# EAGLE design openSX70-bench-new-v2-1 (EAGLE 9.2.0)
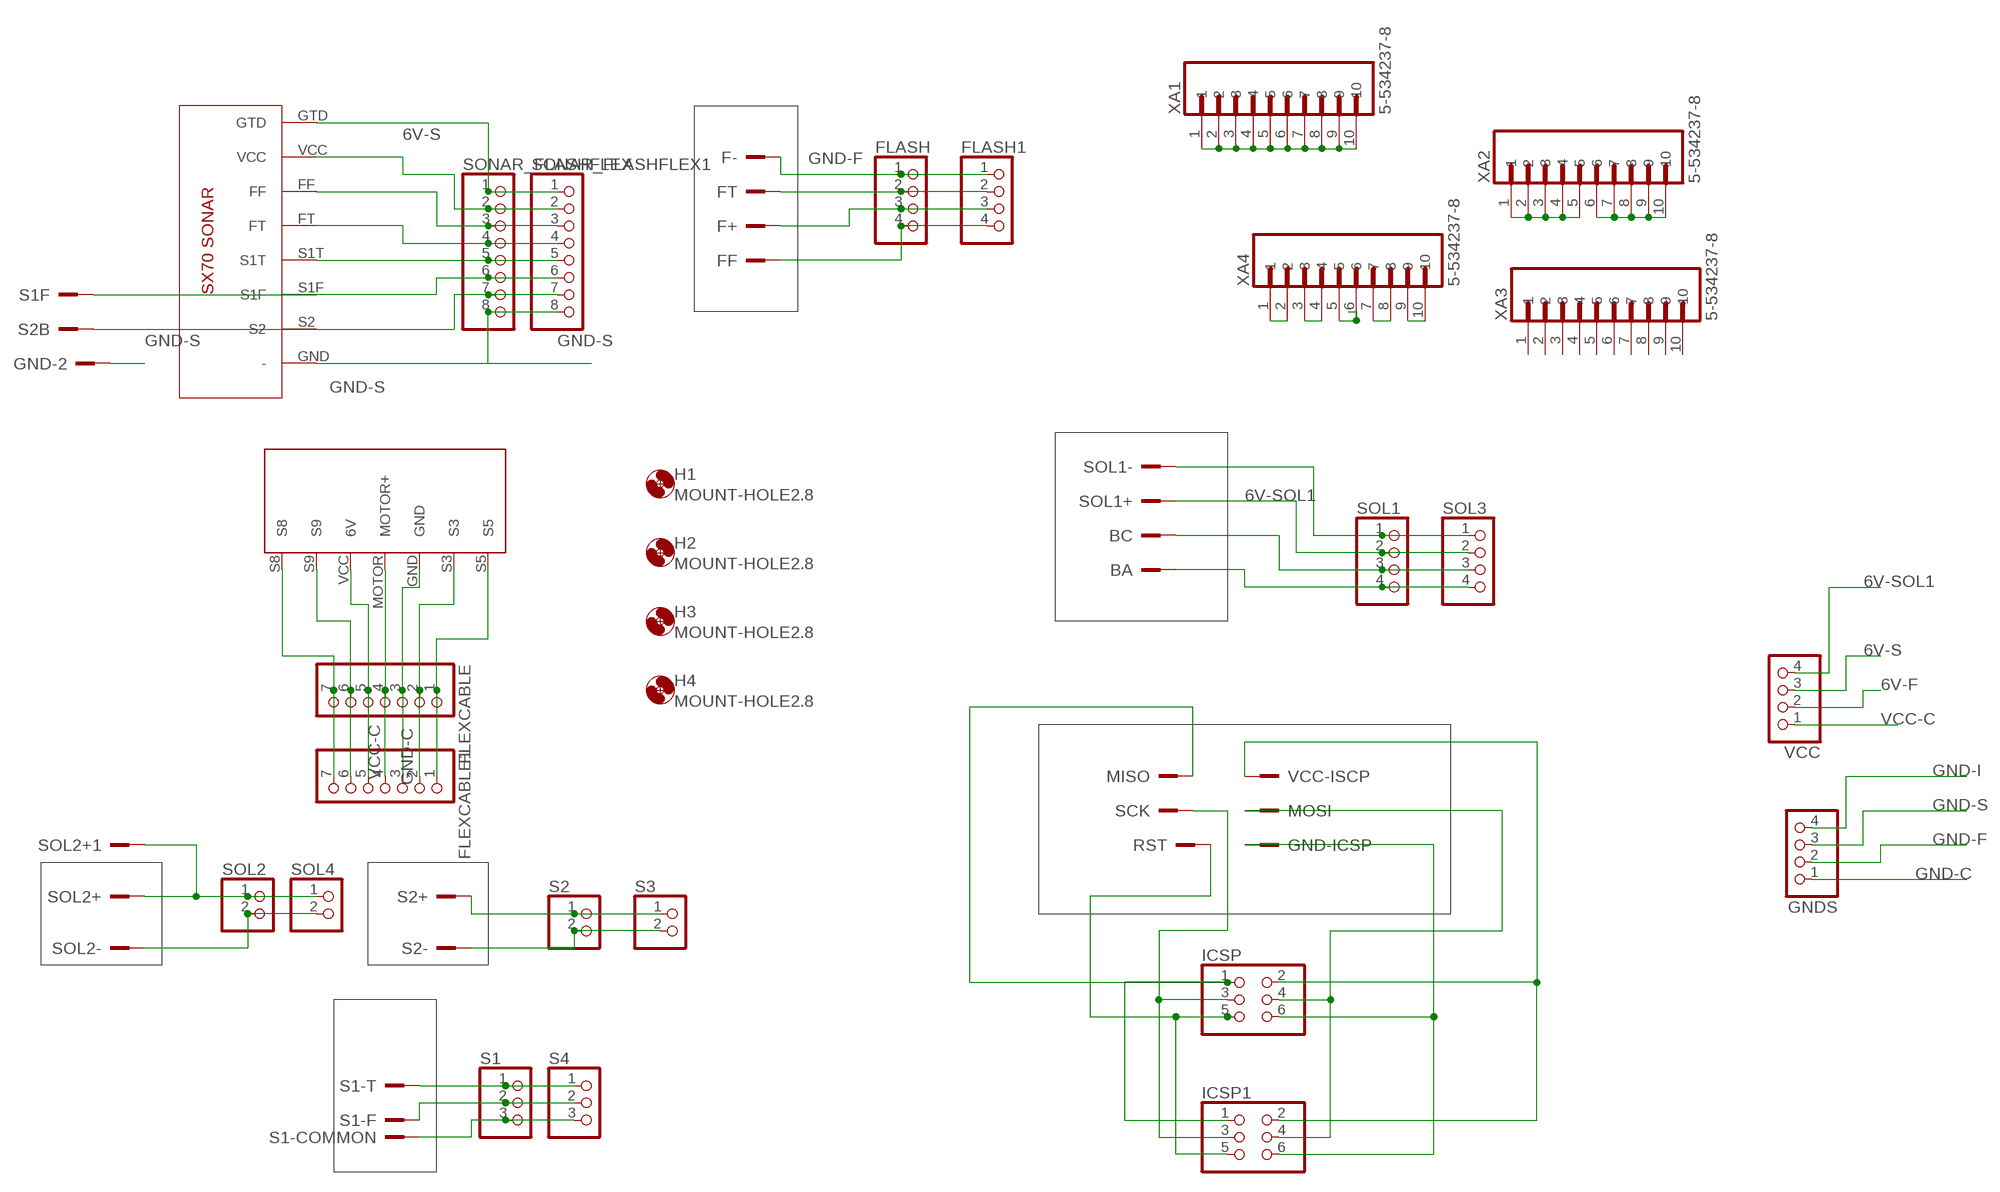
[diagram p0: schematic, sheet 1]

## Parts
BA  PINHEAD  [1X01]
BC  PINHEAD  [1X01]
F+  PINHEAD  [1X01]
F-  PINHEAD  [1X01]
FF  PINHEAD  [1X01]
FLASH  PINHD-1X4  [1X04]
FLASH1  PINHD-1X4  [1X04]
FLEXCABLE  PINHD-1X7  [1X07]
FLEXCABLE1  PINHD-1X7  [1X07]
FT  PINHEAD  [1X01]
GND-2  PINHEAD  [1X01]
GND-ICSP  PINHEAD  [1X01]
GNDS  PINHD-1X4  [1X04]
H1  MOUNT-HOLE2.8  [2,8]
H2  MOUNT-HOLE2.8  [2,8]
H3  MOUNT-HOLE2.8  [2,8]
H4  MOUNT-HOLE2.8  [2,8]
ICSP  PINHD-2X3  [2X03]
ICSP1  PINHD-2X3  [2X03]
MISO  PINHEAD  [1X01]
MOSI  PINHEAD  [1X01]
RST  PINHEAD  [1X01]
S1  PINHD-1X3  [1X03]
S1-COMMON  PINHEAD  [1X01]
S1-F  PINHEAD  [1X01]
S1-T  PINHEAD  [1X01]
S1F  PINHEAD  [1X01]
S2  PINHD-1X2  [1X02]
S2+  PINHEAD  [1X01]
S2-  PINHEAD  [1X01]
S2B  PINHEAD  [1X01]
S3  PINHD-1X2  [1X02]
S4  PINHD-1X3  [1X03]
SCK  PINHEAD  [1X01]
SOL1  PINHD-1X4  [1X04]
SOL1+  PINHEAD  [1X01]
SOL1-  PINHEAD  [1X01]
SOL2  PINHD-1X2  [1X02]
SOL2+  PINHEAD  [1X01]
SOL2+1  PINHEAD  [1X01]
SOL2-  PINHEAD  [1X01]
SOL3  PINHD-1X4  [1X04]
SOL4  PINHD-1X2  [1X02]
SONAR_FLASHFLEX  PINHD-1X8  [1X08]
SONAR_FLASHFLEX1  PINHD-1X8  [1X08]
U$1  SX70-7-PAD-HOLES-PROPER  [SX70-7-PAD-PROPER-HOLES2]
U$2  SX70-SONAR-FLASHFLEX-HOLES  [SONAR-FLASHFLEX-HOLES]
VCC  PINHD-1X4  [1X04]
VCC-ISCP  PINHEAD  [1X01]
XA1  5-534237-8  [TE_5-534237-8]
XA2  5-534237-8  [TE_5-534237-8]
XA3  5-534237-8  [TE_5-534237-8]
XA4  5-534237-8  [TE_5-534237-8]

## Nets
6V-F: F+.1(KL) FLASH1.3 FLASH.3 VCC.2
6V-I: ICSP1.2 ICSP.2 VCC-ISCP.1(KL)
6V-S: SONAR_FLASHFLEX1.2 SONAR_FLASHFLEX.2 U$2.VCC VCC.3
6V-SOL1: SOL1+.1(KL) SOL1.2 SOL3.2 VCC.4
GND-C: FLEXCABLE1.3 FLEXCABLE.3 GNDS.1 U$1.GND
GND-F: F-.1(KL) FLASH1.1 FLASH.1 GNDS.2
GND-I: GND-ICSP.1(KL) GNDS.4 ICSP1.6 ICSP.6
GND-S: GND-2.1(KL) GNDS.3 SONAR_FLASHFLEX1.8 SONAR_FLASHFLEX.8 U$2.GND(-)
N$1: FLEXCABLE1.7 FLEXCABLE.7 U$1.S8
N$2: FLEXCABLE1.6 FLEXCABLE.6 U$1.S9
N$3: XA1.1 XA1.2 XA1.3 XA1.4 XA1.5 XA1.6 XA1.7 XA1.8 XA1.9 XA1.10
N$4: FLEXCABLE1.4 FLEXCABLE.4 U$1.MOTOR(MOTOR+)
N$5: XA4.1 XA4.2
N$6: FLEXCABLE1.2 FLEXCABLE.2 U$1.S3
N$7: FLEXCABLE1.1 FLEXCABLE.1 U$1.S5
N$8: ICSP1.1 ICSP.1 MISO.1(KL)
N$9: ICSP1.3 ICSP.3 SCK.1(KL)
N$10: ICSP1.5 ICSP.5 RST.1(KL)
N$11: XA4.3 XA4.4
N$12: ICSP1.4 ICSP.4 MOSI.1(KL)
N$13: S2B.1(KL) SONAR_FLASHFLEX1.7 SONAR_FLASHFLEX.7 U$2.S2
N$14: S1F.1(KL) SONAR_FLASHFLEX1.6 SONAR_FLASHFLEX.6 U$2.S1F
N$15: SONAR_FLASHFLEX1.5 SONAR_FLASHFLEX.5 U$2.S1T
N$16: SONAR_FLASHFLEX1.1 SONAR_FLASHFLEX.1 U$2.GTD
N$17: SONAR_FLASHFLEX1.3 SONAR_FLASHFLEX.3 U$2.FF
N$18: SONAR_FLASHFLEX1.4 SONAR_FLASHFLEX.4 U$2.FT
N$19: XA4.5 XA4.6
N$20: XA4.7 XA4.8
N$21: S1-COMMON.1(KL) S1.3 S4.3
N$22: S1-F.1(KL) S1.2 S4.2
N$23: FLASH1.2 FLASH.2 FT.1(KL)
N$24: S1-T.1(KL) S1.1 S4.1
N$25: FF.1(KL) FLASH1.4 FLASH.4
N$26: SOL1-.1(KL) SOL1.1 SOL3.1
N$27: XA4.9 XA4.10
N$28: BC.1(KL) SOL1.3 SOL3.3
N$29: BA.1(KL) SOL1.4 SOL3.4
N$30: XA2.1 XA2.2 XA2.3 XA2.4 XA2.5
N$31: XA2.6 XA2.7 XA2.8 XA2.9 XA2.10
N$34: SOL2+1.1(KL) SOL2+.1(KL) SOL2.1 SOL4.1
N$35: SOL2-.1(KL) SOL2.2 SOL4.2
N$38: S2+.1(KL) S2.1 S3.1
N$39: S2-.1(KL) S2.2 S3.2
VCC-C: FLEXCABLE1.5 FLEXCABLE.5 U$1.VCC(6V) VCC.1
Unconnected: XA3.1 XA3.2 XA3.3 XA3.4 XA3.5 XA3.6 XA3.7 XA3.8 XA3.9 XA3.10

## Library data of the parts
BA BC F+ F- FF FT GND-2 GND-ICSP MISO MOSI RST S1-COMMON S1-F S1-T S1F S2+ S2- S2B SCK SOL1+ SOL1- SOL2+ SOL2+1 SOL2- VCC-ISCP = openSX70:PINHEAD
FLASH FLASH1 GNDS SOL1 SOL3 VCC = pinhead:PINHD-1X4: PIN HEADER
FLEXCABLE FLEXCABLE1 = pinhead:PINHD-1X7: PIN HEADER
H1-H4 = holes:MOUNT-HOLE: MOUNTING HOLE with drill center marker
ICSP ICSP1 = pinhead:PINHD-2X3: PIN HEADER
S1 S4 = pinhead:PINHD-1X3: PIN HEADER
S2 S3 SOL2 SOL4 = pinhead:PINHD-1X2: PIN HEADER
SONAR_FLASHFLEX SONAR_FLASHFLEX1 = pinhead:PINHD-1X8: PIN HEADER
U$1 = openSX70:SX70-7-PAD-HOLES-PROPER
U$2 = _openSX70:SX70-SONAR-FLASHFLEX-HOLES
XA1-XA4 = Common-Parts-Library-Eagle:5-534237-8: Conn Socket Strip SKT 10 POS 2.54mm Solder ST Thru-Hole Tube; MANUFACTURER: TE Connectivity

## Net classes
0 default: width 0.305 mm
1 GND: width 0.508 mm
2 VCC: width 0.508 mm

## Board
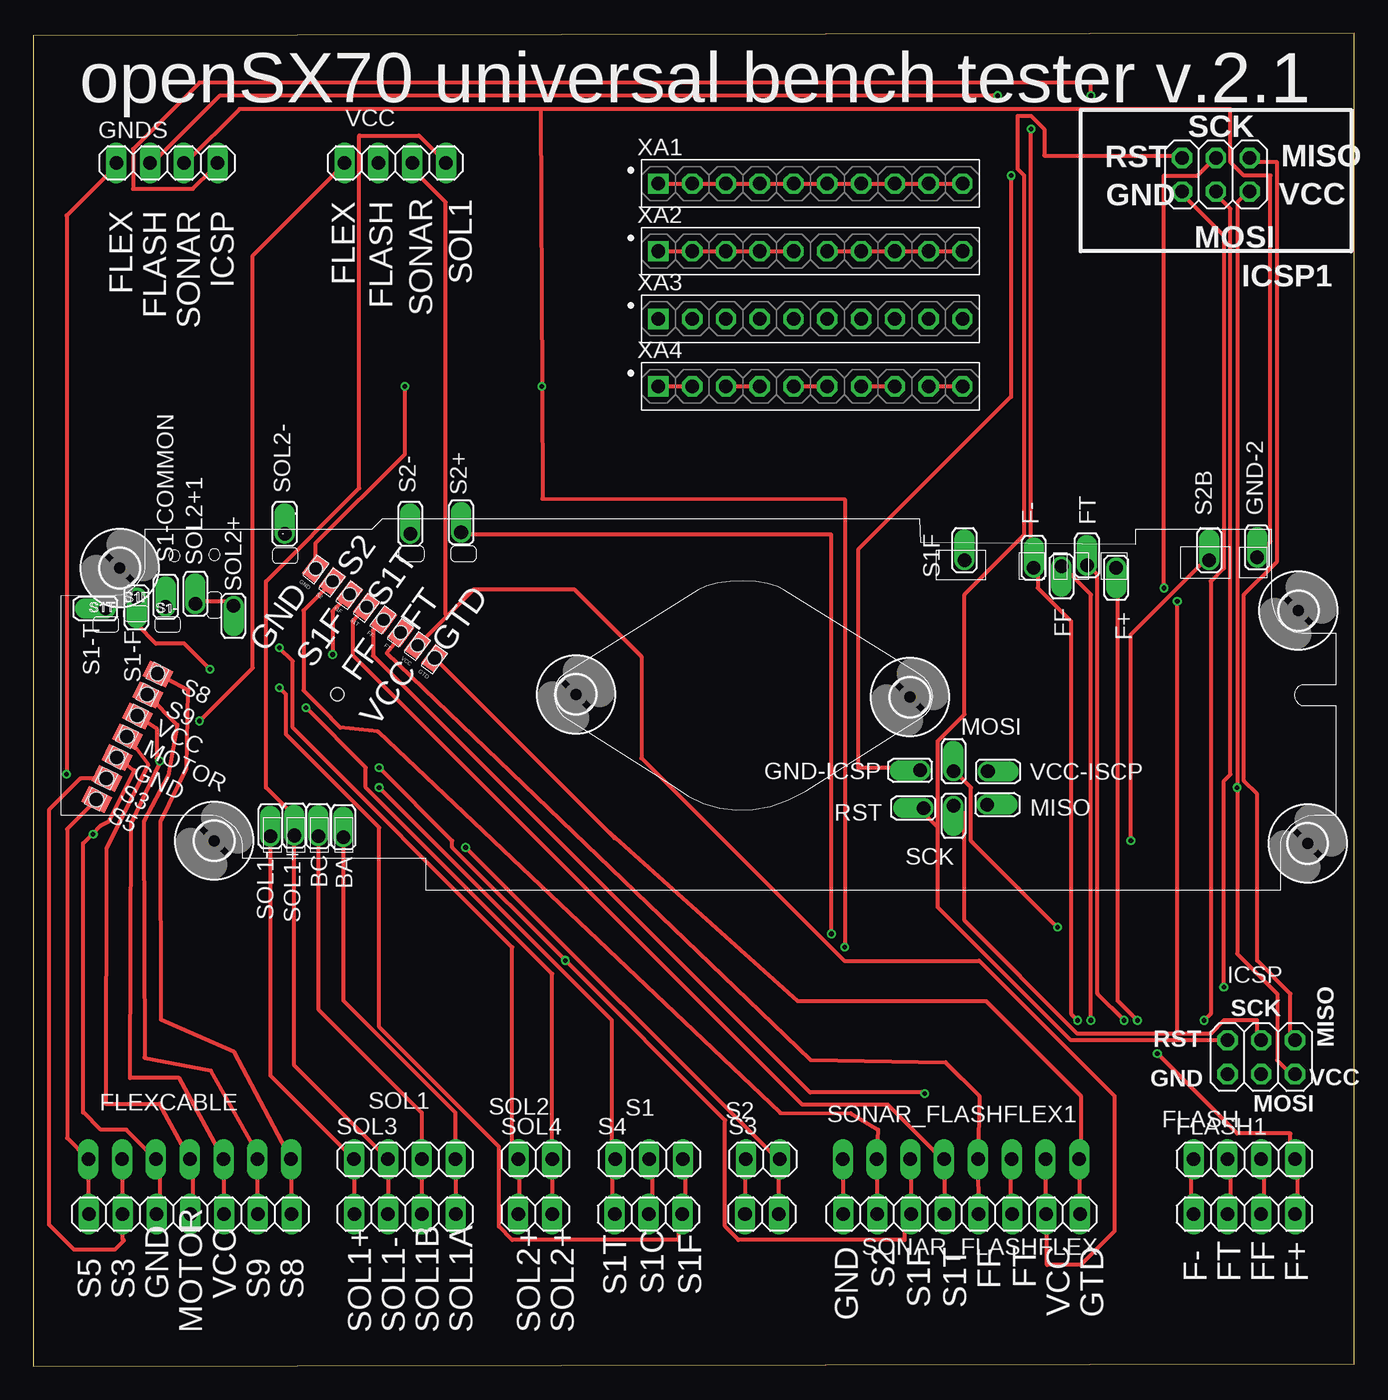
[diagram p1: board, top side]
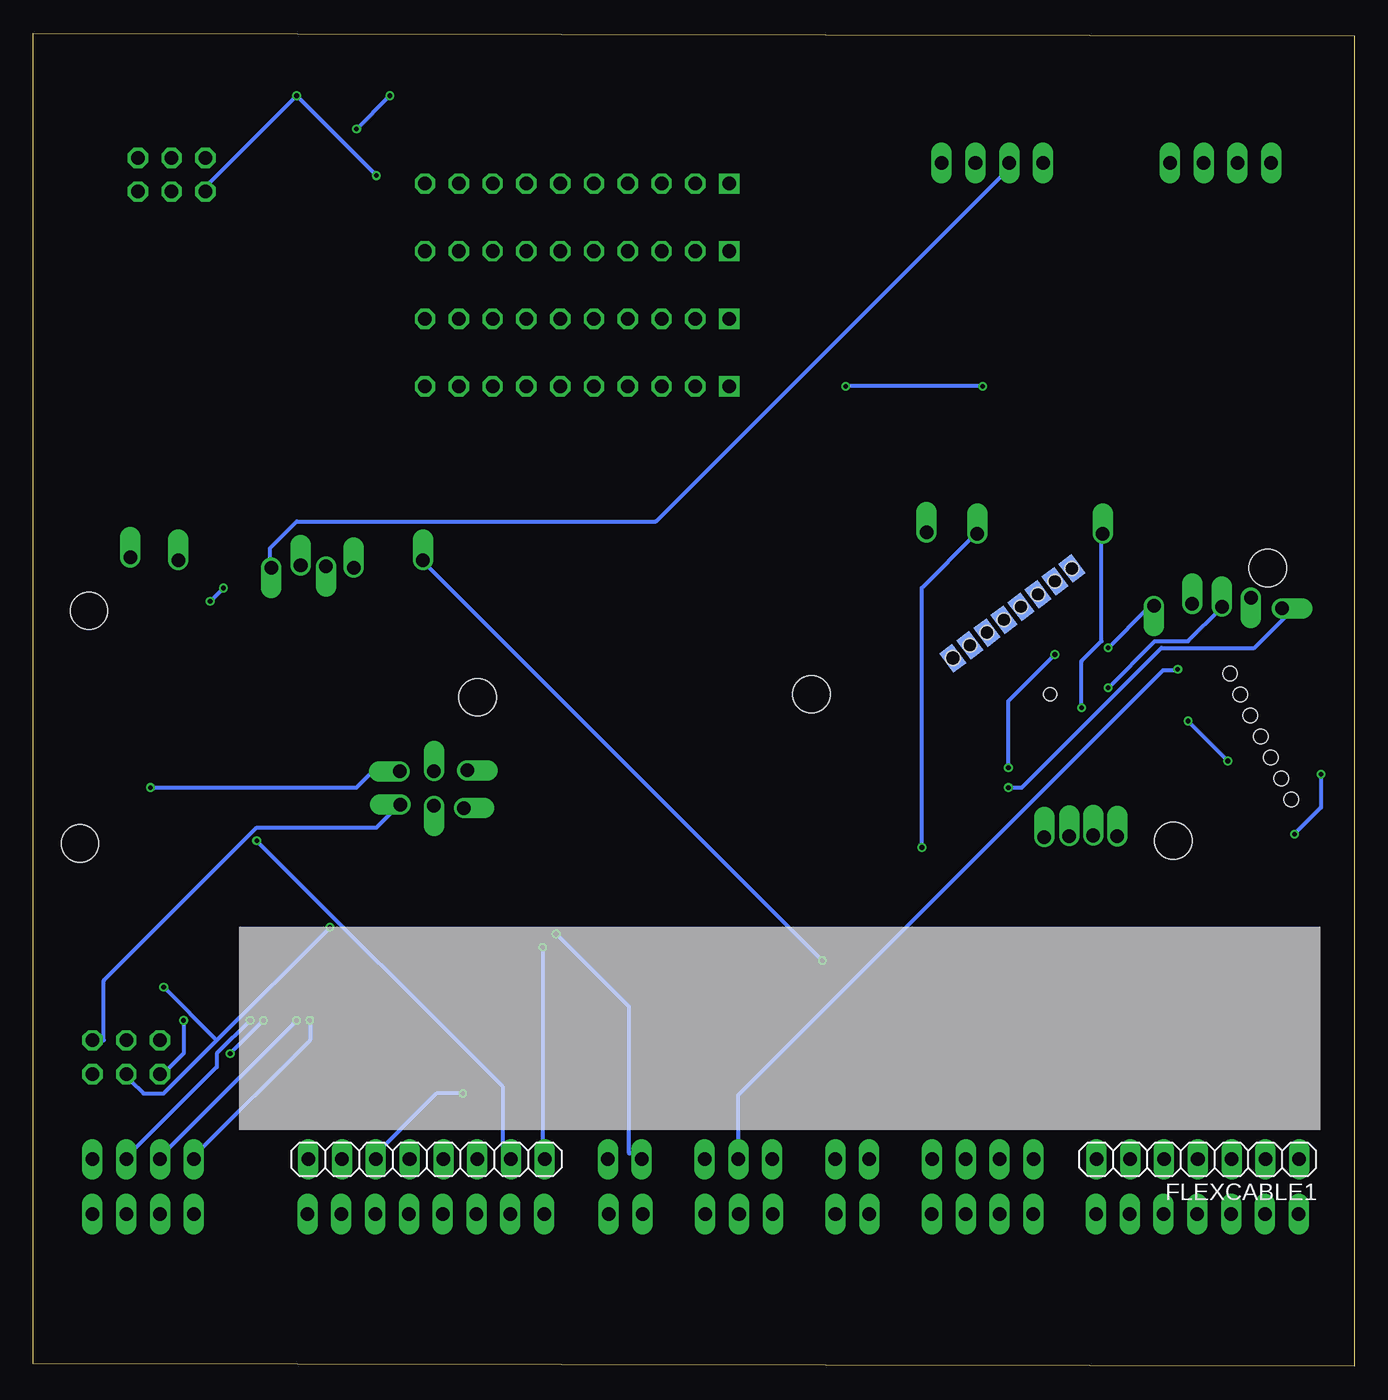
[diagram p2: board, bottom side, seen from below]

Size 99.3 x 100.2 mm. Coordinates in mm from the lower left corner, seen from the top.
Outline: 0,0 99.3,0.2 99.3,100.2 0,100 0,0
Copper layers (1*16): Top 0.035mm / dielectric 1.5mm / Bottom 0.035mm
Design rules "SeeedStudio_2layer_DRU_no_angle_20140221": minimum track width 6mil, minimum drill 12mil, track to track 6mil, track to pad 6mil, pad to pad 6mil, via to via 6mil, smd to smd 0mil, copper to edge 10mil, drill to drill 10mil, minimum pad ring 10mil, minimum via ring 6mil, stop-mask expansion 2mil, vias tented up to drill 100mil, thermal gap 10mil
Holes 1 mm at 22.87,50.52

### Footprints (pad centres in the part's own frame; a part is rotated, then mirrored left to right if it is on the bottom)
1X01 = drill 1.016 offset: 1 0,0
1X04 = drill 1.016 long: 1 -3.81,0; 2 -1.27,0; 3 1.27,0; 4 3.81,0
1X07 = drill 1.016 long: 1 -7.62,0; 2 -5.08,0; 3 -2.54,0; 4 0,0; 5 2.54,0; 6 5.08,0; 7 7.62,0
2,8 = hole 2.8: 0,0
2X03 = drill 1.016 octagon: 1 -2.54,-1.27; 2 -2.54,1.27; 3 0,-1.27; 4 0,1.27; 5 2.54,-1.27; 6 2.54,1.27
1X03 = drill 1.016 long: 1 -2.54,0; 2 0,0; 3 2.54,0
1X02 = drill 1.016 long: 1 -1.27,0; 2 1.27,0
1X08 = drill 1.016 long: 1 -8.89,0; 2 -6.35,0; 3 -3.81,0; 4 -1.27,0; 5 1.27,0; 6 3.81,0; 7 6.35,0; 8 8.89,0
SX70-7-PAD-PROPER-HOLES2 = smd 1.31 x 1.93: GND 7.875,1.355; MOTOR 6.125,1.355; S3 9.625,1.355; S5 11.375,1.355; S8 0.875,1.355; S9 2.625,1.355; VCC 4.375,1.355 | hole 1.1: 0.875,1.312; 2.625,1.312; 4.375,1.312; 6.125,1.312; 7.875,1.312; 9.625,1.312; 11.375,1.312
SONAR-FLASHFLEX-HOLES = smd 1.2 x 1.78: FF -3.2,-0.8; FT -4.8,-0.8; GND 3.2,-0.8; GTD -8,-0.8; S1 1.6,-0.8; S1F 0,-0.8; S1T -1.6,-0.8; S2 1.6,-0.8; VCC -6.4,-0.8 | smd 1.2 x 1.78 bottom: FFB -3.2,-0.8; FTB -4.8,-0.8; GNDB 3.2,-0.8; GTDB -8,-0.8; S1FB 0,-0.8; S1TB -1.6,-0.8; S2B 1.6,-0.8; VCCB -6.4,-0.8 | hole 1.1: -8,-0.8 | hole 1: -6.4,-0.8; -4.8,-0.8; -3.2,-0.8; 3.2,-0.8; -1.6,-0.8; 0,-0.8; 1.6,-0.8
TE_5-534237-8 = drill 1.016 square: 1 -11.43,0 | drill 1.016 octagon: 2 -8.89,0; 3 -6.35,0; 4 -3.81,0; 5 -1.27,0; 6 1.27,0; 7 3.81,0; 8 6.35,0; 9 8.89,0; 10 11.43,0

### Placement (x,y rotation side)
BA  23.3,39.78 90 top
BC  21.42,39.86 90 top
F+  81.4,60.02 270 top
F-  75.2,60.02 90 top
FF  79.2,60.2 90 top
FLASH  91.04,11.44 0 top
FLASH1  91.04,15.56 0 top
FLEXCABLE  11.8,11.44 0 top
FLEXCABLE1  11.76,15.56 180 bottom
FT  77.3,60.12 270 top
GND-2  92,60.8 90 top
GND-ICSP  66.68,44.79 180 top
GNDS  10.05,90.45 0 top
H1  6.5,60 180 top
H2  13.6,39.5 0 top
H3  95.8,39.3 0 top
H4  95.1,56.8 0 top
H5  MOUNT-HOLE2.8  [2,8]  40.8,50.5 0 top
H6  MOUNT-HOLE2.8  [2,8]  65.9,50.3 0 top
ICSP  92.31,23.23 180 top
ICSP1  88.9,89.57 180 top
MISO  71.7,42.22 0 top
MOSI  69.18,44.74 90 top
RST  66.92,41.96 180 top
S1  46.25,11.44 0 top
S1-COMMON  9.95,57.09 90 top
S1-F  7.76,57.78 270 top
S1-T  5.44,56.96 180 top
S1F  70,60.6 90 top
S2  54.77,11.44 0 top
S2+  32.16,62.68 90 top
S2-  28.34,62.58 90 top
S2B  88.4,60.6 90 top
S3  54.84,15.56 0 top
S4  46.29,15.56 0 top
SCK  69.18,42.12 270 top
SOL1  27.94,11.44 0 top
SOL1+  19.62,39.9 90 top
SOL1-  17.82,39.84 90 top
SOL2  37.73,11.44 0 top
SOL2+  15.05,57.15 270 top
SOL2+1  12.18,57.31 90 top
SOL2-  18.9,62.58 90 top
SOL3  27.93,15.56 0 top
SOL4  37.75,15.56 0 top
SONAR_FLASHFLEX  69.79,11.44 180 top
SONAR_FLASHFLEX1  69.74,15.56 0 bottom
U$1  8.54,53.42 244 top
U$2  23.3,57.4 143 top
VCC  27.21,90.45 0 top
VCC-ISCP  71.76,44.71 0 top
XA1  58.42,88.9 0 top
XA2  58.42,83.82 0 top
XA3  58.42,78.74 0 top
XA4  58.42,73.66 0 top

### Tracks (layer width: path | path; a pad name or v marks a point on that pad's centre or on a via)
6V-F  (via drill 0.35)
  Top 0.305: FLASH.3 92.5,11.5 92.5,15.5 FLASH1.3 | v83,26 81.5,27.5 81.5,60 F+.1
  Bottom 0.305: VCC.2 26,90 52.5,63.5 79.5,63.5 81.5,61.5 81.5,60.5 F+.1 | v83,26 85.5,23.5 85.5,22.5 92,16 FLASH1.3
6V-I  (via drill 0.35)
  Top 0.305: ICSP.2 94.5,22 93.5,23 93.5,28 90.5,31 v90.5,43.5 90.5,87.5 91,88 ICSP1.2
  Bottom 0.305: v90.5,43.5 75,43.5 74,44.5 72,44.5 VCC-ISCP.1
6V-S
  Top 0.305: 31.1,56.4 33.12,58.42 40.64,58.42 45.72,53.34 45.72,45.72 60.96,30.48 71.12,30.48 81.28,20.32 81.28,10.16 78.74,7.62 76.2,7.62 76.2,10.16 | 76.2,10.16 76.2,11.38 SONAR_FLASHFLEX.2 | SONAR_FLASHFLEX1.2 76.09,10.27 76.2,10.16 | VCC.3 28.5,90 31,87.5 31,56.5 31.1,56.4 | U$2.VCC 31.1,56.4
6V-SOL1
  Top 0.305: SOL1.2 26.66,11.45 SOL3.2 19.62,22.6 SOL1+.1 19.5,40 19.5,41.5 17.5,43.5 17.5,59 24.5,66 24.5,92.5 29,92.5 31,90.5 VCC.4
GND-C  (via drill 0.35)
  Top 0.305: 4.47,40.03 3.75,39.31 3.75,19.07 3.79,19.07 5.08,17.78 7,17.78 FLEXCABLE1.3 9.5,15.5 9.5,11.5 FLEXCABLE.3 | 4.47,40.03 5.08,40.64 5.66,40.94 7.6,44.79 U$1.GND | v2.5,44.5 2.5,86.5 6,90 GNDS.1 | v4.5,40 4.47,40.03
  Bottom 0.305: v4.5,40 2.5,42 v2.5,44.5
GND-F  (via drill 0.35)
  Top 0.305: FLASH.1 87,11.5 87,15.5 FLASH1.1 | v72.5,95.5 14,95.5 9,90.5 GNDS.2 | v75,93 75,60.5 F-.1 75.5,60 75.5,58.5 78,56 78,26.5 v78.5,26
  Bottom 0.305: v75,93 v72.5,95.5 | v78.5,26 78.5,24.5 87,16 FLASH1.1
GND-I  (via drill 0.35)
  Top 0.305: v79.5,95.5 79.5,96.5 12.5,96.5 7.5,91.5 7.5,88.5 12,88.5 13.5,90 GNDS.4 | v88,26 88.5,26.5 88.5,59 89.5,60 89.5,85 86.5,88 ICSP1.6 | v73.5,89.5 73.5,72.88 62,61.38 62,45 66.5,45 GND-ICSP.1
  Bottom 0.305: ICSP1.6 86.5,88.5 v79.5,95.5 v73.5,89.5 | v88,26 88,23.5 89.5,22 ICSP.6
GND-S  (via drill 0.35)
  Top 0.305: SONAR_FLASHFLEX1.8 60.85,11.49 SONAR_FLASHFLEX.8 | 38.14,94.5 90,94.5 90,90.5 91,89.5 93,89.5 93,62 92,61 GND-2.1 | 38.14,94.5 15.5,94.5 11.5,90.5 GNDS.3 | 38.14,94.5 v38.23,73.66 38.27,65.2 61,65.16 v61,31.5 | U$2.GND 21.23,61.87 27.94,68.58 v27.94,73.66
  Bottom 0.305: v61,31.5 61,16 SONAR_FLASHFLEX1.8 | v27.94,73.66 v38.23,73.66
N$1
  Top 0.305: U$1.S8 11.66,50.83 11.52,44.97 9.57,40.97 9.61,26.05 15.1,23.63 FLEXCABLE1.7 19.38,11.46 19.5,11.5 FLEXCABLE.7
N$2
  Top 0.305: U$1.S9 10.82,48.22 10.14,44.4 8.31,40.97 8.36,23.19 13.34,22.24 17.3,15.27 FLEXCABLE1.6 16.88,15.52 FLEXCABLE.6
N$3
  Top 0.305: XA1.1 XA1.2 XA1.3 XA1.4 XA1.5 XA1.6 XA1.7 XA1.8 XA1.9 XA1.10
N$4
  Top 0.305: U$1.MOTOR 8.64,45.22 5.53,38.97 5.5,38.94 5.44,19.74 9.47,19.73 FLEXCABLE1.4 12,15.5 12,11.5 FLEXCABLE.4
N$5
  Top 0.305: XA4.1 XA4.2
N$6
  Top 0.305: U$1.S3 3.54,44.17 1.17,41.81 1.17,10.66 3.05,8.78 6.15,8.78 6.83,9.46 6.72,9.57 6.72,10.16 | 6.72,10.16 FLEXCABLE.2 | FLEXCABLE1.2 6.68,10.2 6.72,10.16
N$7
  Top 0.305: U$1.S5 2.54,40.37 2.54,17.16 FLEXCABLE1.1 4.14,11.48 FLEXCABLE.1
N$8
  Top 0.305: ICSP1.1 91.5,90.5 93.5,90.5 93.5,60.5 91,58 91,44 92,43 92,30.5 94.5,28 94.5,24.5 ICSP.1
  Bottom 0.305: ICSP.1 94,24.5 94,29 82.5,40.5 73.5,40.5 72,42 MISO.1
N$9  (via drill 0.35)
  Top 0.305: 86,25 88.5,25 89.5,26 92,26 92,24.5 ICSP.3 | 86,25 78.5,25 70,33.5 70,41.5 69.5,42 SCK.1 | v85,58.5 85,89.5 87.5,89.5 88.5,90.5 ICSP1.3 | 86,25 v86,57.5
  Bottom 0.305: v86,57.5 v85,58.5
N$10
  Top 0.305: 68,40.5 67,41.5 RST.1 | 68,40.5 68,34.5 78,24.5 ICSP.5 | 68,40.5 68,47 70,49 70,58 74.5,62.5 74.5,89.5 74,90 74,94 75,94 76,93 76,91 86,91 ICSP1.5
N$11
  Top 0.305: XA4.3 XA4.4
N$12  (via drill 0.35)
  Top 0.305: v77,33 70.5,39.5 70.5,43.5 69.5,44.5 MOSI.1 | v89.5,28.5 89.5,44 90,44.5 90,87 89,88 ICSP1.4
  Bottom 0.305: 85.5,24.5 89.5,20.5 91,20.5 92,21.5 ICSP.4 | 85.5,24.5 v77,33 | 85.5,24.5 v89.5,28.5
N$13  (via drill 0.35)
  Top 0.305: SONAR_FLASHFLEX.7 SONAR_FLASHFLEX1.7 63.5,17.78 61.44,19.01 56.17,19.04 25.91,47.71 23.08,48.01 22.36,48.73 22.36,48.76 20.32,50.8 20.32,56.82 U$2.S2 | v82.5,39.5 82.5,55 88,60.5 S2B.1
  Bottom 0.305: v82.5,39.5 64,21 64,16 63.5,16 SONAR_FLASHFLEX1.7
N$14  (via drill 0.35)
  Top 0.305: v26,45 31.5,39.5 31.5,39 v40,30.5 52,18.5 52,10.5 53,9.5 65.5,9.5 65.5,11 SONAR_FLASHFLEX.6 66,11.5 66,15.5 SONAR_FLASHFLEX1.6 | U$2.S1F 22.5,56.76 v22.5,53.5
  Bottom 0.305: v22.5,53.5 26,50 v26,45 | v40,30.5 70,60.5 S1F.1
N$15
  Top 0.305: SONAR_FLASHFLEX.5 68.5,11.5 68.5,15.5 SONAR_FLASHFLEX1.5 68,16 67.89,16 64.24,19.66 57.82,19.66 24.02,53.46 24.02,56.03 U$2.S1T
N$16
  Top 0.305: SONAR_FLASHFLEX.1 78.63,11.49 SONAR_FLASHFLEX1.1 78.74,15.45 78.74,20.32 71.63,27.43 57.47,27.43 43.76,39.7 | 43.76,39.7 43.13,40.26 | U$2.GTD 43.69,39.7 43.76,39.7
N$17  (via drill 0.35)
  Top 0.305: SONAR_FLASHFLEX1.3 73.5,15.5 73.5,11.5 SONAR_FLASHFLEX.3 | v67,20.5 66.98,20.57 58.4,20.57 25.58,53.4 25.54,53.42 25.54,55.32 U$2.FF
  Bottom 0.305: v67,20.5 69,20.5 73.5,16 SONAR_FLASHFLEX1.3
N$18
  Top 0.305: U$2.FT 27.61,54.89 26.58,53.61 58.44,23.01 68.58,22.86 71.12,20.32 SONAR_FLASHFLEX1.4 SONAR_FLASHFLEX.4
N$19
  Top 0.305: XA4.5 XA4.6
N$20
  Top 0.305: XA4.7 XA4.8
N$21  (via drill 0.35)
  Top 0.305: S4.3 49,15.5 49,11.5 S1.3 48.5,11 48.5,9.5 36,9.5 35,10.5 35,16.5 26,25.5 26,40.5 19,47.5 19,50.5 v18.5,51
  Bottom 0.305: v18.5,51 15,54.5 12.5,54.5 10,57 S1-COMMON.1
N$22  (via drill 0.35)
  Top 0.305: S1.2 46.5,11.5 46.5,15.5 S4.2 | v13.27,52.4 11.32,54.35 9.25,54.35 9.22,54.32 7.76,55.78 S1-F.1
  Bottom 0.305: S4.2 46.29,20.4 14.37,52.32 13.35,52.32 v13.27,52.4
N$23  (via drill 0.35)
  Top 0.305: FLASH.2 90,11.5 90,15.5 FLASH1.2 | v79.5,26 79.5,58 77.5,60 FT.1
  Bottom 0.305: v79.5,26 89.5,16 FLASH1.2
N$24  (via drill 0.35)
  Top 0.305: S1.1 43.5,11.5 43.5,15.5 S4.1 43.5,16 43.5,26 v26,43.5
  Bottom 0.305: v26,43.5 25,43.5 14.5,54 7.5,54 5,56.5 S1-T.1
N$25  (via drill 0.35)
  Top 0.305: FLASH.4 95,11.5 95,15.5 FLASH1.4 94.5,16 94.5,17.5 90.5,17.5 v84.5,23.5 | v82,26 80,28 80,59.5 79.5,60 FF.1
  Bottom 0.305: v84.5,23.5 v82,26
N$26
  Top 0.305: SOL1-.1 17.82,21.86 SOL3.1 24.13,15.55 SOL1.1
N$27
  Top 0.305: XA4.9 XA4.10
N$28
  Top 0.305: BC.1 21.42,26.84 29.2,19.06 SOL3.3 29.2,10.94 29.21,10.95 SOL1.3
N$29
  Top 0.305: BA.1 23.3,27.5 31.74,19.06 SOL3.4 31.74,11.45 SOL1.4
N$30
  Top 0.305: XA2.1 XA2.2 XA2.3 XA2.4 XA2.5
N$31
  Top 0.305: XA2.6 XA2.7 XA2.8 XA2.9 XA2.10
N$34  (via drill 0.35)
  Top 0.305: SOL2+1.1 12.5,57.5 15,57.5 SOL2+.1 | SOL2.1 36.5,11.5 36.5,15.5 SOL4.1 36,16 36,31.5 19.5,48 19.5,53 v18.5,54
  Bottom 0.305: v18.5,54 15.5,57 SOL2+.1
N$35  (via drill 0.35)
  Top 0.305: SOL2.2 39,15.5 SOL4.2 39,16 39,29.5 25,43.5 25,45 v20.5,49.5
  Bottom 0.305: v20.5,49.5 20.5,53 19,54.5 19,62.5 SOL2-.1
N$38  (via drill 0.35)
  Top 0.305: S2.1 53.5,15.5 S3.1 | v60,32.5 60,62.5 32.5,62.5 S2+.1
  Bottom 0.305: v60,32.5 54.5,27 54.5,16 54,16 S3.1
N$39  (via drill 0.35)
  Top 0.305: 56,15.5 56,11.5 S2.2 | 56,15.5 v32.5,39 | 56,15.5 S3.2
  Bottom 0.305: v32.5,39 32.5,58.5 28.5,62.5 S2-.1
VCC-C  (via drill 0.35)
  Top 0.305: 9.55,45.42 7.35,40.86 7.28,21.67 10.96,21.67 FLEXCABLE1.5 14.3,11.48 FLEXCABLE.5 | 9.55,45.42 9.28,45.7 9.28,47.95 U$1.VCC | v12.5,48.5 16.5,52.5 16.5,83.5 23,90 VCC.1 | v9.5,45.5 9.55,45.42
  Bottom 0.305: v9.5,45.5 v12.5,48.5

### Text on the board
tNames: openSX70 universal bench tester v.2.1 | SCK | RST | MISO | MISO | FLEX | FLASH | SONAR | SOL1 | FLEX | FLASH | SONAR | ICSP | GND | VCC | MOSI | S2 | S1T | GND | FT | GTD | S1F | FF | VCC | S8 | S9 | VCC | MOTOR | GND | S3 | S5 | SCK | RST | MISO | GND | VCC | MOSI | GND | S2 | S1F | S1T | FF | FT | VCC | GTD | F- | FT | FF | F+ | S5 | S3 | GND | VCC | S9 | S8 | S1T | S1C | S1F | MOTOR | SOL1+ | SOL1- | SOL1B | SOL1A | SOL2+ | SOL2+